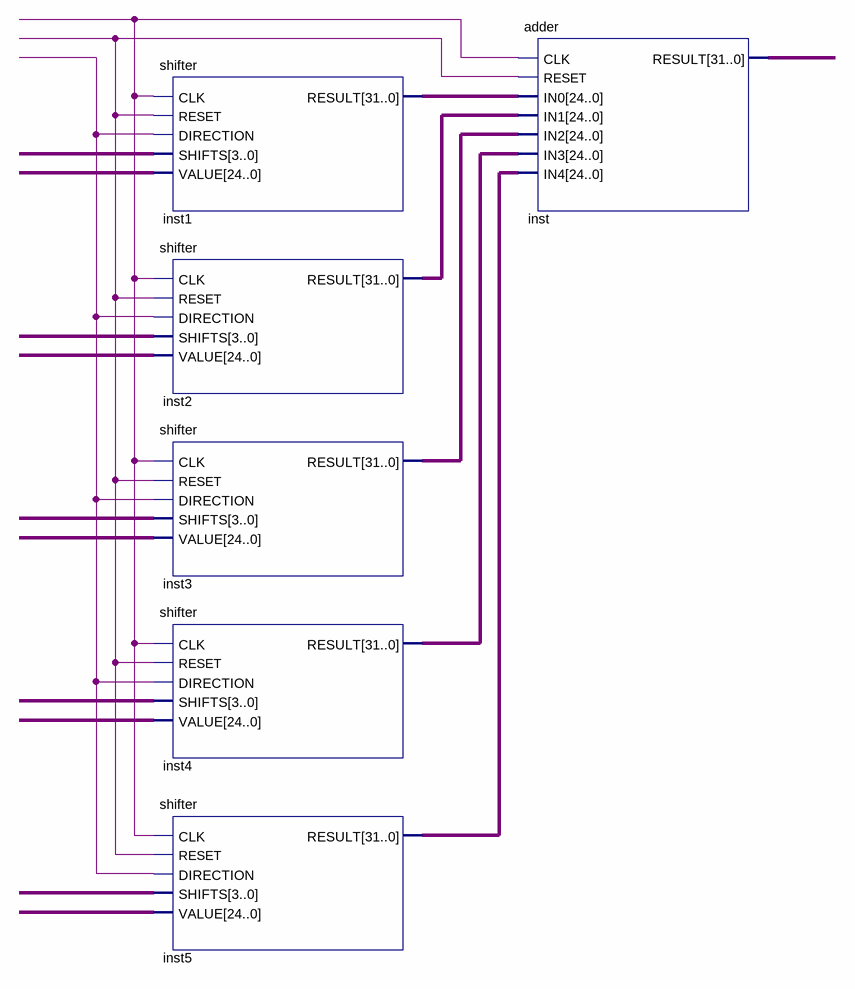
[diagram p0: schematic sheet]
// Quartus schematic converter.bdf as structural Verilog: 6 symbols, 0 pins
module converter (
);

  wire undriven, undriven_2, undriven_7;
  wire [3:0] undriven_3, undriven_5, undriven_8, undriven_10, undriven_12;
  wire [24:0] undriven_4, undriven_6, undriven_9, undriven_11, undriven_13;
  wire [31:0] inst1_result, inst2_result, inst3_result, inst4_result, inst5_result, inst_result;

  shifter inst1 (
    .CLK(undriven), .RESET(undriven_2), .DIRECTION(undriven_7), .SHIFTS(undriven_3), .VALUE(undriven_4),
    .RESULT(inst1_result));
  shifter inst2 (
    .CLK(undriven), .RESET(undriven_2), .DIRECTION(undriven_7), .SHIFTS(undriven_5), .VALUE(undriven_6),
    .RESULT(inst2_result));
  shifter inst3 (
    .CLK(undriven), .RESET(undriven_2), .DIRECTION(undriven_7), .SHIFTS(undriven_8), .VALUE(undriven_9),
    .RESULT(inst3_result));
  shifter inst4 (
    .CLK(undriven), .RESET(undriven_2), .DIRECTION(undriven_7), .SHIFTS(undriven_10), .VALUE(undriven_11),
    .RESULT(inst4_result));
  shifter inst5 (
    .CLK(undriven), .RESET(undriven_2), .DIRECTION(undriven_7), .SHIFTS(undriven_12), .VALUE(undriven_13),
    .RESULT(inst5_result));
  adder inst (
    .CLK(undriven), .RESET(undriven_2), .IN0(inst1_result), .IN1(inst2_result), .IN2(inst3_result),
    .IN3(inst4_result), .IN4(inst5_result), .RESULT(inst_result));
endmodule
